# Altium project MASTER_HW.PrjPcb (part 2 of 4)

## Sheet [4] Shutdown.SchDoc
size A4; DocumentNumber: 4; SheetNumber: 5; SheetTotal: 9
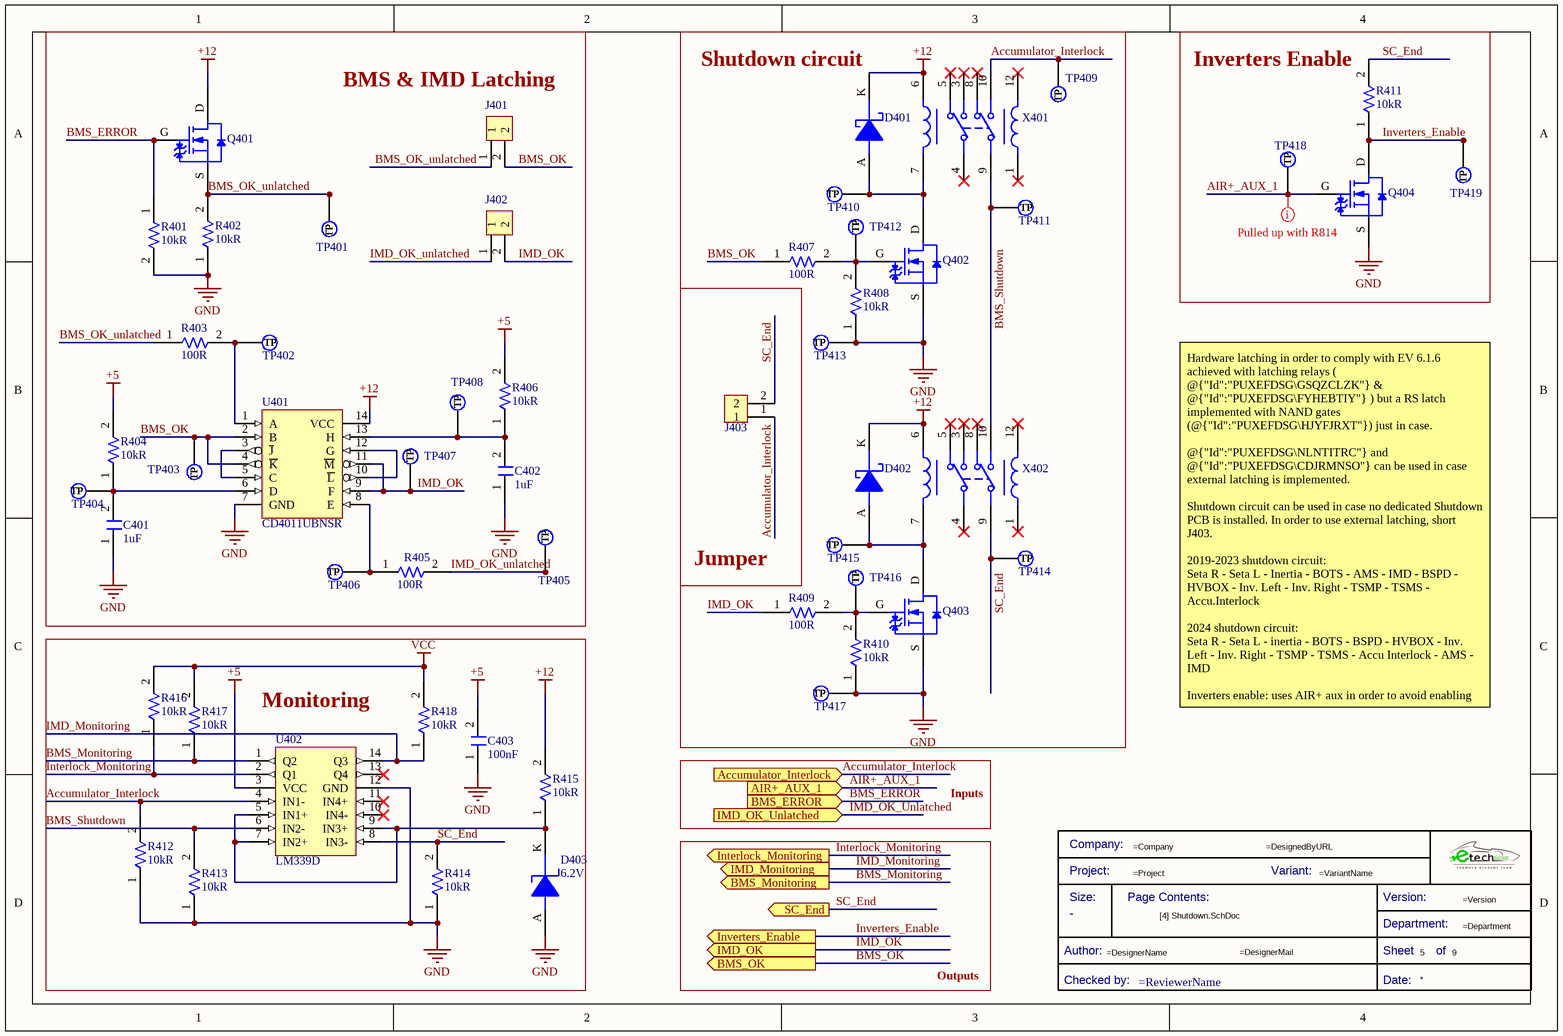
[diagram p2: [4] Shutdown.SchDoc]

### Parts
(Parts that share a designator on the sheet are numbered #1, #2 ... from top to bottom, then left to right.)
*#2  Title Block_template  (value not drawn)  (graphical)
C401  Capacitance: 1uF  [C0805FNPC-R]  (hidden comment: 885012207103)
C402  Capacitance: 1uF  [C0805FNPC-R]  (hidden comment: 885012207103)
C403  Capacitance: 100nF  [C0805FNPC-R]  (hidden comment: 885012207098)
D401  MBR0530  [DSC-SOD123]  (value not drawn)
D402  MBR0530  [DSC-SOD123]  (value not drawn)
D403  Zener Voltage: 6.2V  [DZ-6.2V-DO-214AC]  (hidden comment: BZG05C6V2-E3-TR)
J401  61300211121  [J_Pinheader_1x2]  (value not drawn)
J402  61300211121  [J_Pinheader_1x2]  (value not drawn)
J403  61300211121  [J_Pinheader_1x2]  (value not drawn)
Q401  CPH3455-TL-H  [TRT-NCH-3/35-CPH]  (value not drawn)
Q402  CPH3455-TL-H  [TRT-NCH-3/35-CPH]  (value not drawn)
Q403  CPH3455-TL-H  [TRT-NCH-3/35-CPH]  (value not drawn)
Q404  CPH3455-TL-H  [TRT-NCH-3/35-CPH]  (value not drawn)
R401  Resistance: 10kR  [R0805FTK]  (hidden comment: CR0805-JW-103ELF)
R402  Resistance: 10kR  [R0805FTK]  (hidden comment: CR0805-JW-103ELF)
R403  Resistance: 100R  [R0805FTK]  (hidden comment: CR0805-FX-1000ELF)
R404  Resistance: 10kR  [R0805FTK]  (hidden comment: CR0805-JW-103ELF)
R405  Resistance: 100R  [R0805FTK]  (hidden comment: CR0805-FX-1000ELF)
R406  Resistance: 10kR  [R0805FTK]  (hidden comment: CR0805-JW-103ELF)
R407  Resistance: 100R  [R0805FTK]  (hidden comment: CR0805-FX-1000ELF)
R408  Resistance: 10kR  [R0805FTK]  (hidden comment: CR0805-JW-103ELF)
R409  Resistance: 100R  [R0805FTK]  (hidden comment: CR0805-FX-1000ELF)
R410  Resistance: 10kR  [R0805FTK]  (hidden comment: CR0805-JW-103ELF)
R411  Resistance: 10kR  [R0805FTK]  (hidden comment: CR0805-JW-103ELF)
R412  Resistance: 10kR  [R0805FTK]  (hidden comment: CR0805-JW-103ELF)
R413  Resistance: 10kR  [R0805FTK]  (hidden comment: CR0805-JW-103ELF)
R414  Resistance: 10kR  [R0805FTK]  (hidden comment: CR0805-JW-103ELF)
R415  Resistance: 10kR  [R0805FTK]  (hidden comment: CR0805-JW-103ELF)
R416  Resistance: 10kR  [R0805FTK]  (hidden comment: CR0805-JW-103ELF)
R417  Resistance: 10kR  [R0805FTK]  (hidden comment: CR0805-JW-103ELF)
R418  Resistance: 10kR  [R0805FTK]  (hidden comment: CR0805-JW-103ELF)
TP401  TestPoint  [TestPoint]  (value not drawn)  (no BOM)
TP402  TestPoint  [TestPoint]  (value not drawn)  (no BOM)
TP403  TestPoint  [TestPoint]  (value not drawn)  (no BOM)
TP404  TestPoint  [TestPoint]  (value not drawn)  (no BOM)
TP405  TestPoint  [TestPoint]  (value not drawn)  (no BOM)
TP406  TestPoint  [TestPoint]  (value not drawn)  (no BOM)
TP407  TestPoint  [TestPoint]  (value not drawn)  (no BOM)
TP408  TestPoint  [TestPoint]  (value not drawn)  (no BOM)
TP409  TestPoint  [TestPoint]  (value not drawn)  (no BOM)
TP410  TestPoint  [TestPoint]  (value not drawn)  (no BOM)
TP411  TestPoint  [TestPoint]  (value not drawn)  (no BOM)
TP412  TestPoint  [TestPoint]  (value not drawn)  (no BOM)
TP413  TestPoint  [TestPoint]  (value not drawn)  (no BOM)
TP414  TestPoint  [TestPoint]  (value not drawn)  (no BOM)
TP415  TestPoint  [TestPoint]  (value not drawn)  (no BOM)
TP416  TestPoint  [TestPoint]  (value not drawn)  (no BOM)
TP417  TestPoint  [TestPoint]  (value not drawn)  (no BOM)
TP418  TestPoint  [TestPoint]  (value not drawn)  (no BOM)
TP419  TestPoint  [TestPoint]  (value not drawn)  (no BOM)
U401  Manufacturer Part Number: CD4011UBNSR  [ARRAY_4_NAND]  (hidden comment: CD4011UBSNR)
U402  LM339D  [Array_4_Amp_LM339D]
X401  Relay_V23079  [Relay_V23079]  (value not drawn)
X402  Relay_V23079  [Relay_V23079]  (value not drawn)

### Blocks framed on the sheet
BMS & IMD Latching: C401 C402 J401 J402 Q401 R401-R406 TP401-TP408 U401
Shutdown circuit: D401 D402 Q402 Q403 R407-R410 TP409-TP417 X401 X402
Inverters Enable: Q404 R411 TP418 TP419
Jumper: J403
Monitoring: C403 D403 R412-R418 U402

### Ports
Accumulator_Interlock (in), AIR+_AUX_1 (in), BMS_ERROR (in), BMS_Monitoring (out), BMS_OK (out), IMD_Monitoring (out), IMD_OK (out), IMD_OK_Unlatched (in), Interlock_Monitoring (out), Inverters_Enable (out), SC_End (out)

### Nets
+5: C403.2 R404.2 R406.2 U402.3(VCC)
+12: D401.K D402.K Q401.D R415.2 U401.14(VCC) X401.6 X402.6
GND: C401.1 C402.1 C403.1 D403.A Q402.S Q403.S Q404.S R401.2 R402.1 R408.1 R410.1 R412.1 R413.1 R414.1 TP413.1(TP) TP417.1(TP) U401.7(GND) U402.12(GND)
VCC: R416.2 R417.2 R418.2
Accumulator_Interlock: J403.1 R412.2 TP409.1(TP) U402.4(IN1-) X401.10 ; port Accumulator_Interlock
AIR+_AUX_1: Q404.G TP418.1(TP) ; port AIR+_AUX_1
BMS_ERROR: Q401.G R401.1 ; port BMS_ERROR
BMS_Monitoring: R417.1 U402.1(Q2) ; port BMS_Monitoring
BMS_OK: J401.2 R407.1 TP403.1(TP) U401.2(B) U401.4(~{K}) ; port BMS_OK
BMS_OK_unlatched: J401.1 Q401.S R402.2 R403.1 TP401.1(TP)
BMS_Shutdown: R413.2 TP411.1(TP) U402.6(IN2-) X401.9 X402.10
IMD_Monitoring: R418.1 U402.14(Q3) ; port IMD_Monitoring
IMD_OK: J402.2 R409.1 TP407.1(TP) U401.9(F) U401.11(~{M}) ; port IMD_OK
IMD_OK_unlatched: J402.1 R405.2 TP405.1(TP) ; port IMD_OK_Unlatched
Interlock_Monitoring: R416.1 U402.2(Q1) ; port Interlock_Monitoring
Inverters_Enable: Q404.D R411.1 TP419.1(TP) ; port Inverters_Enable
SC_End: J403.2 R411.2 R414.2 TP414.1(TP) U402.8(IN3-) X402.9 ; port SC_End
NetC401_2: C401.2 R404.1 TP404.1(TP) U401.6(D)
NetC402_2: C402.2 R406.1 TP408.1(TP) U401.13(H)
NetD401_A: D401.A Q402.D TP410.1(TP) X401.7
NetD402_A: D402.A Q403.D TP415.1(TP) X402.7
NetD403_K: D403.K R415.1 U402.5(IN1+) U402.7(IN2+) U402.9(IN3+)
NetQ402_G: Q402.G R407.2 R408.2 TP412.1(TP)
NetQ403_G: Q403.G R409.2 R410.2 TP416.1(TP)
NetR403_2: R403.2 TP402.1(TP) U401.1(A)
NetR405_1: R405.1 TP406.1(TP) U401.8(E)
NetU401_3: U401.3(~{J}) U401.5(C)
NetU401_10: U401.10(~{L}) U401.12(G)

Not connected (* = marked no-connect by the designer): U402 10(IN4-)* 11(IN4+)* 13(Q4)*; X401 1* 3* 4* 5* 8* 12*; X402 1* 3* 4* 5* 8* 12*

### Layout directives
mark named Pulled up with R814: AIR+_AUX_1

### Notes on the sheet
- Hardware latching in order to comply with EV 6.1.6 achieved with latching relays ( @{"Id":"PUXEFDSG\GSQZCLZK"} & @{"Id":"PUXEFDSG\FYHEBTIY"} ) but a RS latch implemented with NAND gates (@{"Id":"PUXEFDSG\HJYFJRXT"}) just in case.
  @{"Id":"PUXEFDSG\NLNTITRC"} and @{"Id":"PUXEFDSG\CDJRMNSO"} can be used in case external latching is implemented.
  Shutdown circuit can be used in case no dedicated Shutdown PCB is installed. In order to use external latching, short J403.
  2019-2023 shutdown circuit:
  Seta R - Seta L - Inertia - BOTS - AMS - IMD - BSPD - HVBOX - Inv. Left - Inv. Right - TSMP - TSMS - Accu.Interlock
  2024 shutdown circuit:
  Seta R - Seta L - inertia - BOTS - BSPD - HVBOX - Inv. Left - Inv. Right - TSMP - TSMS - Accu Interlock - AMS - IMD
  Inverters enable: uses AIR+ aux in order to avoid enabling the inverters when no bus voltage is present (check Bamocar D3 manual). Can be ommited if enable is given with LVMS.
- Inputs
- Outputs
- Title
- Size:
- Date:
- A4
- Number:
- Time:
- Revision:
- Sheet
- of
- File:
- (in symbol Title Block_template) Company:; Project:; Variant:; Size:; Page Contents:; Version:; Department:; Author:; Sheet; of; Checked by:; Date:

### Library data of the parts
*#2 = Title Block_template: Standard Title Block; Category: Title Block; Checked by:: =ReviewerName; Size: -
C401 C402 = C1u-50V-0805FNPC-X7R: Multilayer Ceramic Capacitor, Wcap-Csgp Series, 1 F, 10%, X7R, 50 V, 0805 [2012 Metric] Rohs Compliant: Yes; Manufacturer 1: Wurth Electronics; Voltage Rating: 50V; .Creator: GP; Supplier 1: RSComponents; Manufacturer Part Number 1: 885012207103; RoHS: Yes; Category: Ceramic Capacitors; Stock 1: 5100; Pricing 1: 50=0,27200, 250=0,25300, 500=0,22800, 1250=0,20100, 2500=0,17100 (GBP); Mount: Surface Mount; Case/Package: 0805; Case Code (Metric): 2012; Case Code (Imperial): 0805; Min Operating Temperature: -55°C; Max Operating Temperature: 85°C; Packaging: Cut Tape; Dielectric: X7R; Tolerance: 10%; Voltage Rating (DC): 50V; Length: 0.079inch; Width: 0.049inch; Thickness: 0.053inch; REACH SVHC: Unknown; RoHS Compliant: Yes; ComponentLink1URL: http://www.farnell.com/datasheets/1958501.pdf?src-supplier=Farnell; ComponentLink1Description: http://www.farnell.com/datasheets/1958501.pdf?src-supplier=Farnell; ComponentLink2URL: http://www.farnell.com/datasheets/1958501.pdf?src-supplier=Element14; ComponentLink2Description: http://www.farnell.com/datasheets/1958501.pdf?src-supplier=Element14; ComponentLink3URL: https://katalog.we-online.de/pbs/datasheet/885012107003.pdf?src-supplier=Digi-Key; ComponentLink3Description: https://katalog.we-online.de/pbs/datasheet/885012107003.pdf?src-supplier=Digi-Key; ComponentLink4URL: http://www.farnell.com/datasheets/1958501.pdf?src-supplier=Newark; ComponentLink4Description: http://www.farnell.com/datasheets/1958501.pdf?src-supplier=Newark; Supplier Part Number 1: 1813523
C403 = C100n-50V-0805FNPC-X7R: Cap, 0.1ΜF, 50V, 10%, X7R, 0805; Manufacturer 1: Wurth Electronics; .Creator: DR; Supplier 1: RSComponents; Manufacturer Part Number 1: 885012207098; RoHS: Yes; Category: Ceramic Capacitors; Stock 1: 8000; Pricing 1: 100=0,10200, 500=0,07100, 2000=0,06100 (GBP); Mount: Surface Mount; Case/Package: 0805; Case Code (Metric): 2012; Case Code (Imperial): 0805; Min Operating Temperature: -55°C; Max Operating Temperature: 125°C; Packaging: Cut Tape; Voltage Rating: 50V; Dielectric: X7R; Tolerance: 10%; Voltage Rating (DC): 50V; Length: 0.079inch; Width: 0.049inch; Thickness: 0.035inch; REACH SVHC: Unknown; RoHS Compliant: Yes; ComponentLink1URL: http://www.farnell.com/datasheets/1958498.pdf?src-supplier=Farnell; ComponentLink1Description: http://www.farnell.com/datasheets/1958498.pdf?src-supplier=Farnell; ComponentLink2URL: http://www.farnell.com/datasheets/1958498.pdf?src-supplier=Element14; ComponentLink2Description: http://www.farnell.com/datasheets/1958498.pdf?src-supplier=Element14; ComponentLink3URL: https://katalog.we-online.de/pbs/datasheet/885012207098.pdf?src-supplier=Digi-Key; ComponentLink3Description: https://katalog.we-online.de/pbs/datasheet/885012207098.pdf?src-supplier=Digi-Key; ComponentLink4URL: http://www.farnell.com/datasheets/1958498.pdf?src-supplier=Newark; ComponentLink4Description: http://www.farnell.com/datasheets/1958498.pdf?src-supplier=Newark; Supplier Part Number 1: 1813493
D401 D402 = DSC-0.5/30-SOD123: VR=30V IF=500mA 30pF P=410mW; Element Configuration: Single; Forward Voltage: 430mV; Peak Non-Repetitive Surge Current: 5.5A; Average Rectified Current: 500mA; Max Reverse Leakage Current: 130uA; Max Reverse Voltage (DC): 30V; Polarity: Standard; .Creator: GP; Category: Diode; ComponentLink1Description: Datasheet; ComponentLink1URL: *; ComponentLink2Description: Where buy it; ComponentLink2URL: *; Supplier 1: Newark; Stock 1: 9; Pricing 1: 1=0,34400, 10=0,23900, 100=0,12200, 500=0,10000 (USD); Mount: Surface Mount; Contact Plating: Tin,Matte; Weight: 0.03g; Package Quantity: 1; Max Surge Current: 5.5A; Forward Current: 500mA; Max Reverse Current: 130uA; Max Repetitive Reverse Voltage (Vrrm): 30V; Max Forward Surge Current (Ifsm): 5.5A; Voltage Rating (DC): 30V; Current Rating: 500mA; Output Current: 500mA; Series: -; Length: 2.7mm; Width: 1.6mm; Height: 1.03mm; Radiation Hardening: No; RoHS Compliant: Yes; REACH SVHC: No SVHC; Lead Free: Lead Free; ComponentLink3URL: https://datasheet.ciiva.com/30479/0900766b810e2512-30479401.pdf?src-supplier=RSComponents; ComponentLink3Description: https://datasheet.ciiva.com/30479/0900766b810e2512-30479401.pdf?src-supplier=RSComponents; ComponentLink4URL: https://datasheet.ciiva.com/34301/974753-34301826.pdf?src-supplier=Jameco; ComponentLink4Description: https://datasheet.ciiva.com/34301/974753-34301826.pdf?src-supplier=Jameco; ComponentLink5URL: https://datasheet.ciiva.com/910/mbr0530-910516.pdf?src-supplier=Digi-Key; ComponentLink5Description: https://datasheet.ciiva.com/910/mbr0530-910516.pdf?src-supplier=Digi-Key; ComponentLink6URL: https://datasheet.ciiva.com/25931/mbr0530-25931989.pdf?src-supplier=Avnet+Europe; ComponentLink6Description: https://datasheet.ciiva.com/25931/mbr0530-25931989.pdf?src-supplier=Avnet+Europe; ComponentLink7URL: https://datasheet.ciiva.com/8300/mbr0530-8300905.pdf?src-supplier=Avnet; ComponentLink7Description: https://datasheet.ciiva.com/8300/mbr0530-8300905.pdf?src-supplier=Avnet; ComponentLink8URL: https://datasheet.ciiva.com/17318/mbr0530-17318568.pdf?src-supplier=Future+Electronics; ComponentLink8Description: https://datasheet.ciiva.com/17318/mbr0530-17318568.pdf?src-supplier=Future+Electronics; ComponentLink9URL: https://datasheet.ciiva.com/15144/getdatasheetpartid-86760-15144598.pdf?src-supplier=Verical; ComponentLink9Description: https://datasheet.ciiva.com/15144/getdatasheetpartid-86760-15144598.pdf?src-supplier=Verical; ComponentLink10URL: https://datasheet.ciiva.com/910/mbr0530-910518.pdf?src-supplier=Digi-Key; ComponentLink10Description: https://datasheet.ciiva.com/910/mbr0530-910518.pdf?src-supplier=Digi-Key; Supplier Part Number 1: 15R3453
D403 = DZ-6.2V-DO-214AC: BZG05C Series 6.2 V 200 mA Surface Mount Zener Diode - DO-214AC; Manufacturer 1: Vishay Semiconductors; Max Power Dissipation: 1.25W; Impedance: 4R; Max Reverse Leakage Current: 1uA; Tolerance: 5%; Test Current: 35mA; .Creator: DO; ComponentLink1Description: Datasheet; ComponentLink1URL: http://www.mouser.com/ds/2/427/bzg05c-710097.pdf?src-supplier=Mouser; ComponentLink2Description: Where buy it; ComponentLink2URL: https://www.mouser.es/ProductDetail/Vishay-Semiconductors/BZG05C6V2-E3-TR?qs=PhR8RmCirEbIeyTQuBsADg%3D%3D; Supplier 1: Farnell; Manufacturer Part Number 1: BZG05C6V2-E3-TR; RoHS: Yes; Category: Zener Diodes; Pricing 1: 1=0,06810 (GBP); Mount: Surface Mount; Number of Pins: 2; Contact Plating: Tin,Matte; Min Operating Temperature: -65°C; Max Operating Temperature: 150°C; Packaging: Tape and Reel; RoHS Compliant: Yes; Lead Free: Lead Free; ComponentLink3URL: http://www.mouser.com/ds/2/427/bzg05c-710097.pdf?src-supplier=Mouser; ComponentLink3Description: http://www.mouser.com/ds/2/427/bzg05c-710097.pdf?src-supplier=Mouser; ComponentLink4URL: http://www.vishay.com/docs/85893/bzg05c.pdf?src-supplier=Avnet; ComponentLink4Description: http://www.vishay.com/docs/85893/bzg05c.pdf?src-supplier=Avnet; ComponentLink5URL: http://www.vishay.com/docs/85893/bzg05c.pdf?src-supplier=Digi-Key; ComponentLink5Description: http://www.vishay.com/docs/85893/bzg05c.pdf?src-supplier=Digi-Key; Supplier Part Number 1: 2690001
J401-J403 = J_Jumper: CONN HEADER 2 POS 2.54; Manufacturer: Molex; Temperature rating: -40° to +105°C; Category type: PCB-PCB; Product name: Pin Header; Maximum current: 3 A; Maximum voltage: 250 V AC; Connections: 1x2; Current Rating: 3A; Voltage Rating: 250V; Number of Positions: 2; Gender: Male; Connector Type: Male Pin; Pitch: 0.1inch; .Creator: GP; Category: Connector; ComponentLink1Description: Datasheet; ComponentLink1URL: https://www.we-online.com/catalog/datasheet/61300211121.pdf; ComponentLink2Description: Where buy it; ComponentLink2URL: https://www.we-online.com/catalog/en/PHD_2_54_THT_PIN_HEADER_6130XX11121?sq=61300211121&sp=https%3A%2F%2Fwww.we-online.com%2Fweb%2Fen%2Fwuerth_elektronik%2Fsearchpage.php%3Fsearch%3D61300211121#61300211121; Manufacturer part number: 61300211121; Supplier: Würth Elektronik; RoHS: *; Application: Shortcircuit; Flammability: 94V-0; Orientation: Vertical; Mount: Through hole; Supplier 1: RSComponents; Stock 1: 1855; Pricing 1: 5=0,14100, 50=0,09700, 100=0,07800, 200=0,07300, 500=0,06800 (USD); Contact Plating: Gold; Housing Material: PBT; Contact Material: Copper Alloy,Copper; Color: Black; Min Operating Temperature: -40°C; Max Operating Temperature: 125°C; Number of Rows: 1; Contact Gender: Male; Packaging: Bulk; Termination: Through Hole; Number of Contacts: 2; Contact Mating Length: 0.236inch; REACH SVHC: Unknown; Lead Free: Lead Free; ComponentLink3URL: https://datasheet.ciiva.com/13619/6130xx11121-48870-13619345.pdf?src-supplier=Mouser; ComponentLink3Description: https://datasheet.ciiva.com/13619/6130xx11121-48870-13619345.pdf?src-supplier=Mouser; Supplier Part Number 1: 8281581
Q401-Q404 = TRT-NCH-3/35-CPH: CPH3455-TL-H N-channel MOSFET Transistor; 3 A; 35 V; 3-Pin CPH; Manufacturer: ON Semiconductor; Rds On Max: 104mR; Input Capacitance: 186pF; Rise Time: 4.7ns; Drain to Source Voltage (Vdss): 35V; Continuous Drain Current (ID): 3A; Max Power Dissipation: 1W; Drain to Source Resistance: 108mR; Turn-On Delay Time: 4.2ns; Turn-Off Delay Time: 15ns; Fall Time: 5.7ns; Element Configuration: Single; Gate to Source Voltage (Vgs): 20V; .Creator: GP; Category: Transistor; ComponentLink1Description: Datasheet; ComponentLink1URL: https://docs.rs-online.com/5847/0900766b812d514d.pdf; ComponentLink2Description: Where buy it; ComponentLink2URL: https://es.rs-online.com/web/p/mosfet/8009989; Supplier 1: RSComponents; Manufacturer Part Number: CPH3455-TL-H; RoHS: Yes; Stock 1: 1; Pricing 1: 50=0,50400 (USD); Case/Package: SC; Number of Pins: 3; Min Operating Temperature: -55°C; Max Operating Temperature: 150°C; Package Quantity: 3000; Packaging: Tape and Reel; Drain to Source Breakdown Voltage: 35V; Power Dissipation: 1W; Polarity: N-CHANNEL; Series: -; Length: 2.9mm; Width: 1.6mm; Height: 0.9mm; Lead Free: Lead Free; Halogen Free: Halogen Free; RoHS Compliant: Yes; ComponentLink3URL: https://datasheet.ciiva.com/947/cph3455-d-947201.pdf?src-supplier=Digi-Key; ComponentLink3Description: https://datasheet.ciiva.com/947/cph3455-d-947201.pdf?src-supplier=Digi-Key; ComponentLink4URL: https://datasheet.ciiva.com/4444/cph3455-d-91653-4444616.pdf?src-supplier=Mouser; ComponentLink4Description: https://datasheet.ciiva.com/4444/cph3455-d-91653-4444616.pdf?src-supplier=Mouser; ComponentLink5URL: https://datasheet.ciiva.com/11164/cph3455-d-11164889.pdf?src-supplier=Avnet; ComponentLink5Description: https://datasheet.ciiva.com/11164/cph3455-d-11164889.pdf?src-supplier=Avnet; Supplier Part Number 1: 8009989
R401 R402 R404 R406 R408 R410-R418 = R10k-0805FTK: BOURNS         CR0805-JW-103ELF            Surface Mount Chip Resistor, Thick Film, CR Series, 10 kohm, 125 mW,  5%, 150 V; Temperature Coefficient: 200ppm/°C; Power Rating: 125mW; Voltage Rating: 150V; Voltage Rating (DC): 100V; .Creator: DR; Supplier 1: Arrow Electronics; Manufacturer 1: Bourns; Manufacturer Part Number 1: CR0805-JW-103ELF; RoHS: Yes; Category: Chip SMD Resistors; Stock 1: 57566; Pricing 1: 1=0,05790, 10=0,01540, 25=0,01340, 100=0,00340 (USD); Mount: Surface Mount; Case/Package: 0805; Number of Pins: 2; Contact Plating: Tin; Case Code (Metric): 2012; Case Code (Imperial): 0805; Min Operating Temperature: -55°C; Max Operating Temperature: 155°C; Tolerance: 5%; Resistor Type: Thick Film; Package Quantity: 1; Packaging: Tape and Reel; Number of Terminations: 2; Termination: SMD/SMT; Max Power Dissipation: 125mW; Features: Moisture Resistant; Series: CR0805; Construction: Rectangular; Resistance Tolerance: 5%; Technology: THICK FILM; Length: 2mm; Width: 1.25mm; Height: 0.5mm; Depth: 1.25mm; Thickness: 508um; Radiation Hardening: No; REACH SVHC: No SVHC; Military Standard: Not; RoHS Compliant: Yes; ComponentLink1URL: https://datasheet.ciiva.com/11821/0900766b80fcdb72-11821135.pdf?src-supplier=RSComponents; ComponentLink1Description: https://datasheet.ciiva.com/11821/0900766b80fcdb72-11821135.pdf?src-supplier=RSComponents; ComponentLink2URL: https://datasheet.ciiva.com/9122/chpreztr-9122374.pdf?src-supplier=Avnet; ComponentLink2Description: https://datasheet.ciiva.com/9122/chpreztr-9122374.pdf?src-supplier=Avnet; ComponentLink3URL: https://datasheet.ciiva.com/22693/1902866-22693254.pdf?src-supplier=Element14; ComponentLink3Description: https://datasheet.ciiva.com/22693/1902866-22693254.pdf?src-supplier=Element14; ComponentLink4URL: https://datasheet.ciiva.com/7986/691949-7986187.pdf?src-supplier=Element14; ComponentLink4Description: https://datasheet.ciiva.com/7986/691949-7986187.pdf?src-supplier=Element14; ComponentLink5URL: https://datasheet.ciiva.com/30065/159chpreztr-30065976.pdf?src-supplier=Onlinecomponents.com; ComponentLink5Description: https://datasheet.ciiva.com/30065/159chpreztr-30065976.pdf?src-supplier=Onlinecomponents.com; ComponentLink6URL: https://datasheet.ciiva.com/16783/70154685-16783482.pdf?src-supplier=Allied+Electronics; ComponentLink6Description: https://datasheet.ciiva.com/16783/70154685-16783482.pdf?src-supplier=Allied+Electronics; ComponentLink7URL: https://datasheet.ciiva.com/5548/chpreztr-5548491.pdf?src-supplier=Mouser; ComponentLink7Description: https://datasheet.ciiva.com/5548/chpreztr-5548491.pdf?src-supplier=Mouser; ComponentLink8URL: https://datasheet.ciiva.com/6559/chpreztr-6559900.pdf?src-supplier=Digi-Key; ComponentLink8Description: https://datasheet.ciiva.com/6559/chpreztr-6559900.pdf?src-supplier=Digi-Key; ComponentLink9URL: https://datasheet.ciiva.com/6559/chpreztr-6559901.pdf?src-supplier=Digi-Key; ComponentLink9Description: https://datasheet.ciiva.com/6559/chpreztr-6559901.pdf?src-supplier=Digi-Key; ComponentLink10URL: https://datasheet.ciiva.com/7985/1856384-7985869.pdf?src-supplier=Element14; ComponentLink10Description: https://datasheet.ciiva.com/7985/1856384-7985869.pdf?src-supplier=Element14; ComponentLink11URL: https://datasheet.ciiva.com/48692/001055517-da-01-en-smd-wid-cr0805-jw-103elf-10k-ohm-1-8w-48692118.pdf?src-supplier=Conrad; ComponentLink11Description: https://datasheet.ciiva.com/48692/001055517-da-01-en-smd-wid-cr0805-jw-103elf-10k-ohm-1-8w-48692118.pdf?src-supplier=Conrad; Supplier Part Number 1: CR0805-JW-103ELF
R403 R405 R407 R409 = R100-0805FTK: Res Thick Film 0805 100 Ohm 1% 1/8W ±100ppm/°C Molded SMD SMD Paper Tape on Plastic Reel; Manufacturer 1: Bourns; Power Rating: 125mW; Voltage Rating: 150V; .Creator: DR; Supplier 1: Arrow Electronics; Manufacturer Part Number 1: CR0805-FX-1000ELF; RoHS: Yes; Category: Chip SMD Resistors; Stock 1: 49802; Pricing 1: 1=0,05840, 10=0,03430, 25=0,01780, 100=0,00750, 250=0,00560, 500=0,00490, 3000=0,00470 (USD); Mount: Surface Mount; Case/Package: 0805; Number of Pins: 2; Contact Plating: Tin; Case Code (Imperial): 0805; Case Code (Metric): 2012; Min Operating Temperature: -55°C; Max Operating Temperature: 155°C; Tolerance: 1%; Resistor Type: Thick Film; Temperature Coefficient: 100ppm/°C; Packaging: Tape and Reel; Package Quantity: 1; Termination: SMD/SMT; Number of Terminations: 2; Max Power Dissipation: 125mW; Voltage Rating (DC): 150V; Features: Moisture Resistant; Series: CR0805; Resistance Tolerance: 1%; Construction: Rectangular; Technology: THICK FILM; Length: 2mm; Width: 1.25mm; Height: 0.5mm; Depth: 1.25mm; Thickness: 508um; Radiation Hardening: No; REACH SVHC: No SVHC; Military Standard: Not; RoHS Compliant: Yes; ComponentLink1URL: https://datasheet.ciiva.com/11809/0900766b80fcdb72-11809178.pdf?src-supplier=RSComponents; ComponentLink1Description: https://datasheet.ciiva.com/11809/0900766b80fcdb72-11809178.pdf?src-supplier=RSComponents; ComponentLink2URL: https://datasheet.ciiva.com/6547/chpreztr-6547413.pdf?src-supplier=Digi-Key; ComponentLink2Description: https://datasheet.ciiva.com/6547/chpreztr-6547413.pdf?src-supplier=Digi-Key; ComponentLink3URL: https://datasheet.ciiva.com/6547/chpreztr-6547414.pdf?src-supplier=Digi-Key; ComponentLink3Description: https://datasheet.ciiva.com/6547/chpreztr-6547414.pdf?src-supplier=Digi-Key; ComponentLink4URL: https://datasheet.ciiva.com/6547/chpreztr-6547415.pdf?src-supplier=Digi-Key; ComponentLink4Description: https://datasheet.ciiva.com/6547/chpreztr-6547415.pdf?src-supplier=Digi-Key; ComponentLink5URL: https://datasheet.ciiva.com/9120/chpreztr-9120744.pdf?src-supplier=Avnet; ComponentLink5Description: https://datasheet.ciiva.com/9120/chpreztr-9120744.pdf?src-supplier=Avnet; Supplier Part Number 1: CR0805-FX-1000ELF
TP401-TP419 = TestPoint: Test Point 1x1 mm; .Creator: GP; Category: TestPoint; .PCBcheck: GP; .SCHcheck: GP
U401 = Array_4_NAND: CD4011UB Cmos Quad 2-INPUT Nand; Manufacturer: Texas Instruments; Logic Function: NAND GATE; Min Supply Voltage: 3V; Max Supply Voltage: 18V; Number of Inputs: 2; Propagation Delay: 50ns; Number of Outputs: 1; Number of Circuits: 4; Quiescent Current: 5uA; High Level Output Current: 3.4mA; Output Current: 6.8mA; Turn-On Delay Time: 120ns; .Creator: DO; Supplier 1: Digi-Key; RoHS: Yes; Category: Logic Gates; Stock 1: 964; Pricing 1: 1=0,67000, 10=0,59100, 25=0,55520, 100=0,45320, 250=0,42096, 500=0,35828, 1000=0,29575 (USD); Mount: Surface Mount; Case/Package: SOP; Number of Pins: 14; Weight: 0.007348oz; Contact Plating: Gold; Min Operating Temperature: -55°C; Max Operating Temperature: 125°C; Package Quantity: 1; Packaging: Tape and Reel; Low Level Output Current: 3.4mA; Number of Gates: 4; Number of Input Lines: 2; Number of Output Lines: 1; Number of Elements: 4; Series: 4000B; Technology: CMOS; Number of Bits: 4; Lead Free: Lead Free; RoHS Compliant: Yes; ComponentLink1URL: https://datasheet.ciiva.com/6621/cd4011ub-6621174.pdf?src-supplier=Digi-Key; ComponentLink1Description: https://datasheet.ciiva.com/6621/cd4011ub-6621174.pdf?src-supplier=Digi-Key; ComponentLink2URL: https://datasheet.ciiva.com/6621/cd4011ub-6621175.pdf?src-supplier=Digi-Key; ComponentLink2Description: https://datasheet.ciiva.com/6621/cd4011ub-6621175.pdf?src-supplier=Digi-Key; ComponentLink3URL: https://datasheet.ciiva.com/14307/cd4011ub-mil-14307943.pdf?src-supplier=Avnet; ComponentLink3Description: https://datasheet.ciiva.com/14307/cd4011ub-mil-14307943.pdf?src-supplier=Avnet; ComponentLink4URL: https://datasheet.ciiva.com/6621/cd4011ub-6621176.pdf?src-supplier=Digi-Key; ComponentLink4Description: https://datasheet.ciiva.com/6621/cd4011ub-6621176.pdf?src-supplier=Digi-Key; Supplier Part Number 1: 296-31485-1-ND; ComponentLink5Description: Where buy it; ComponentLink5URL: https://www.digikey.es/es/products/detail/texas-instruments/CD4011UBNSR/1690702?s=N4IgTCBcDaIMIBEAsAGAjGgqgIQHIGUAlAAhAF0BfIA
U402 = Array_4_Amp_LM339D: Comparator Quad ±18V/36V 14-Pin SOIC Tube; Manufacturer: Texas Instruments; Number of Channels: 4; Nominal Supply Current: 2mA; Output Current: 20mA; Quiescent Current: 2.5mA; Max Supply Voltage: 30V; Min Supply Voltage: 2V; Min Dual Supply Voltage: 1V; Max Dual Supply Voltage: 15V; Voltage Gain: 106.02dB; Max Supply Current: 500uA; Input Bias Current: 250nA; Output Current per Channel: 6mA; Input Offset Voltage (Vos): 5mV; Response Time: 0.3us; Output Type: TTL; Dual Supply Voltage: 9V; .Creator: DO; Supplier 1: Digi-Key; RoHS: Yes; Category: Amplifiers - Op Amps, Buffer, Instrumentation; Stock 1: 10834; Pricing 1: 1=0,93000, 10=0,83500, 25=0,79240, 100=0,65090, 250=0,60848, 500=0,53774, 1000=0,46725 (USD); Mount: Surface Mount; Case/Package: SOIC; Number of Pins: 14; Contact Plating: Gold; Weight: 0.004318oz; Min Operating Temperature: 0°C; Max Operating Temperature: 70°C; Packaging: Rail/Tube; Package Quantity: 50; Number of Elements: 4; Supply Current: 2mA; Technology: BIPOLAR; Max Input Current: 250nA; Series: LM339; Length: 8.65mm; Width: 3.91mm; Height: 1.58mm; Radiation Hardening: No; REACH SVHC: No SVHC; Lead Free: Lead Free; RoHS Compliant: Yes; ComponentLink1URL: https://datasheet.ciiva.com/15131/getdatasheetpartid-248452-15131099.pdf?src-supplier=Verical; ComponentLink1Description: https://datasheet.ciiva.com/15131/getdatasheetpartid-248452-15131099.pdf?src-supplier=Verical; ComponentLink2URL: https://datasheet.ciiva.com/1483/1831045-1483000.pdf?src-supplier=Element14; ComponentLink2Description: https://datasheet.ciiva.com/1483/1831045-1483000.pdf?src-supplier=Element14; ComponentLink3URL: https://datasheet.ciiva.com/1827/lm139a-1827534.pdf?src-supplier=Digi-Key; ComponentLink3Description: https://datasheet.ciiva.com/1827/lm139a-1827534.pdf?src-supplier=Digi-Key; ComponentLink4URL: https://datasheet.ciiva.com/2970/lm2901-2970484.pdf?src-supplier=Avnet; ComponentLink4Description: https://datasheet.ciiva.com/2970/lm2901-2970484.pdf?src-supplier=Avnet; ComponentLink5URL: https://datasheet.ciiva.com/48712/001010753-da-01-en-ic-quad-diff-comp-lm339d-soic-14-tid-48712470.pdf?src-supplier=Conrad; ComponentLink5Description: https://datasheet.ciiva.com/48712/001010753-da-01-en-ic-quad-diff-comp-lm339d-soic-14-tid-48712470.pdf?src-supplier=Conrad; Supplier Part Number 1: 296-1013-5-ND; ComponentLink6Description: Where buy it; ComponentLink6URL: https://es.rs-online.com/web/p/comparadores/0858411; Manufacturer Part Number: LM339D
X401 X402 = Relay_V23079: Electromechanical Relay 5VDC 178Ohm 2A DPDT (14.5x7.2x9.8)mm THT Signal Relay; Manufacturer 1: TE Connectivity Axicom; Manufacturer Part Number 1: 3-1393788-3; Voltage Rating (AC): 250V; Voltage Rating (DC): 220V; Coil Current: 28.09mA; Coil Resistance: 178R; Operate Time: 4ms; Coil Power: 140mW; Power Consumption: 130mW; Coil Voltage (DC): 5V; Relay Type: General Purpose; Coil Type: Latching, Dual Coil; Supplier 1: RSComponents; RoHS: Yes; Category: Signal Relays; Stock 1: 3138; Pricing 1: 10=4,27000, 25=4,08000, 50=3,83000, 100=3,62000 (EUR); Mount: Through Hole,PCB; Case/Package: DIP; Number of Pins: 10; Contact Material: Gold,Silver; Contact Plating: Gold; Min Operating Temperature: -40°C; Max Operating Temperature: 85°C; Packaging: Rail/Tube; Max Current Rating: 2A; Contact Current Rating: 2A; Max Voltage Rating (AC): 250V; Max Voltage Rating (DC): 220V; Throw Configuration: DPDT; Termination: PC Pin; Series: V23079, AXICOM; Release Time: 4ms; Application(s): SIGNAL; Length: 14.5mm; Depth: 7.2mm; Radiation Hardening: No; ELV: Compliant; RoHS Compliant: Yes; ComponentLink1URL: https://datasheet.ciiva.com/6759/1486920-6759418.pdf?src-supplier=Newark; ComponentLink1Description: https://datasheet.ciiva.com/6759/1486920-6759418.pdf?src-supplier=Newark; ComponentLink2URL: https://datasheet.ciiva.com/1217/1717898-1217236.pdf?src-supplier=Element14; ComponentLink2Description: https://datasheet.ciiva.com/1217/1717898-1217236.pdf?src-supplier=Element14; ComponentLink3URL: https://datasheet.ciiva.com/30172/13997ddetrolleractionshowdocdocidspecificationorstandard7f108-98002-30172091.pdf?src-supplier=Onlinecomponents.com; ComponentLink3Description: https://datasheet.ciiva.com/30172/13997ddetrolleractionshowdocdocidspecificationorstandard7f108-98002-30172091.pdf?src-supplier=Onlinecomponents.com; Supplier Part Number 1: 515587P